# Altium schematic sheet [03] - CIRCUITO.SchDoc
size A4; DocumentNumber: 3; SheetNumber: 3; SheetTotal: 6
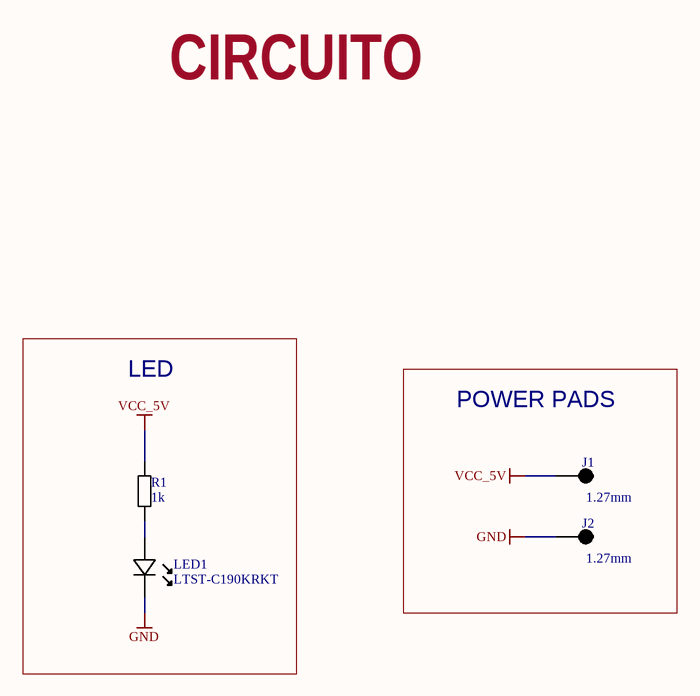
[diagram p0: [03] - CIRCUITO.SchDoc]

## Parts
J1  1.27mm  [SOLDER PAD - 1.27mm]  (no BOM)
J2  1.27mm  [SOLDER PAD - 1.27mm]  (no BOM)
LED1  Manufacturer Part Number: LTST-C190KRKT  [LED-0603-RED]  (hidden comment: RED)
R1  1k  [RESC1608X06N]

## Blocks framed on the sheet
LED: LED1 R1
POWER PADS: J1 J2

## Nets
GND: J2.1 LED1.K
VCC_5V: J1.1 R1.2
NetLED1_A: LED1.A R1.1

## Notes on the sheet
- CIRCUITO
- Projeto:
- Ancient Egypt Ltda
- Revisão:
- Engenheiro:
- Titulo:
- Pág
- de
- Pyramides of Giza, 777
- Cairo
- www.ancientegypt.com.eg
- Data:
- Hora:
- Variante:

## Library data of the parts
J1 J2 = SOLDER_PAD_R_127MM: SOLDER_PAD_ROUND_127MM; pad size: 1.27mm
LED1 = LED RED CLEAR 0603 SMD: Manufacturer: Lite-On Inc.; Lens Color: Colorless; Millicandela Rating: 99mcd; Lens Style/Size: Rectangle with Flat Top, 1.10mm x 0.80mm; Voltage - Forward (Vf) (Typ): 2V; Current - Test: 20mA; Viewing Angle: 130°; Wavelength - Dominant: 631nm; Wavelength - Peak: 639nm; Supplier 1: Digi-Key; RoHS: RoHS Compliant; Category: Optoelectronics; Stock 1: 1118453; Pricing 1: 1=0.27, 10=0.196, 25=0.1448, 100=0.1034, 250=0.07032, 500=0.06204, 1000=0.0486 (USD); Packaging: Cut Tape (CT); Color: Red; Lens Transparency: Clear; Mounting Type: Surface Mount; Features: -; Package / Case: 0603 (1608 Metric); Supplier Device Package: *; Size / Dimension: 1.60mm L x 0.80mm W; Height (Max): 0.80mm; ComponentLink1URL: http://optoelectronics.liteon.com/upload/download/DS-22-99-0151/S_110_LTST-C190KRKT.pdf; ComponentLink1Description: http://optoelectronics.liteon.com/upload/download/DS-22-99-0151/S_110_LTST-C190KRKT.pdf; Supplier Part Number 1: 160-1436-1-ND; Value: RED
R1 = RES 1K 0603 1%: RES SMD 1K OHM 1% 1/10W 0603; Manufacturer: Yageo; Manufacturer Part Number: RC0603JR-071KL; Tolerance: ±5%; Power (Watts): 0.1W, 1/10W; Temperature Coefficient: ±100ppm/°C; Supplier 1: Digi-Key; RoHS: RoHS Compliant; Category: Resistors; Stock 1: 4405000; Pricing 1: 5000=0.00149, 10000=0.00129, 25000=0.00113, 50000=0.00104, 125000=0.00102 (USD); Packaging: Tape & Reel (TR); Part Status: Active; Resistance (Ohms): 1k; Composition: Thick Film; Features: Moisture Resistant; Operating Temperature: -55°C ~ 155°C; Package / Case: 0603 (1608 Metric); Supplier Device Package: 0603; Size / Dimension: 0.063" L x 0.031" W (1.60mm x 0.80mm); Height - Seated (Max): 0.022" (0.55mm); Failure Rate: -; ComponentLink1URL: http://www.yageo.com/documents/recent/PYu-RC_Group_51_RoHS_L_7.pdf; ComponentLink1Description: http://www.yageo.com/documents/recent/PYu-RC_Group_51_RoHS_L_7.pdf; Supplier Part Number 1: 311-1.0KGRTR-ND; value: 1k